# Altium schematic sheet Output.SchDoc: SoldeerStation
size A4; SheetNumber: 4; SheetTotal: 4
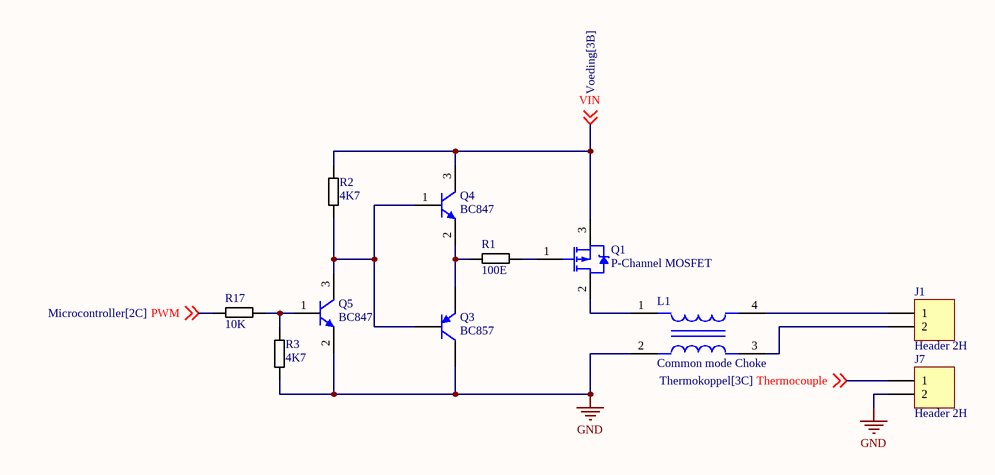
[diagram p0: Output.SchDoc]

## Parts
J1  Header 2H  [Connector_2x1_p_5mm]
J7  Header 2H  [Connector_2x1_p_5mm]
L1  Common mode Choke  [2545]
Q1  P-Channel MOSFET  [INF-PG-TO252-3-313_N]
Q3  BC857  [FAIR-SOT23-3_V]
Q4  BC847  [FAIR-SOT23-3_V]
Q5  BC847  [FAIR-SOT23-3_V]
R1  100E  [RESC2013X50X30ML20T20]
R2  4K7  [RESC2013X50X30ML20T20]
R3  4K7  [RESC2013X50X30ML20T20]
R17  10K  [RESC2013X50X30ML20T20]

## Nets
GND: J7.2 L1.2 Q3.3(C) Q5.2(E) R3.1
PWM: R17.1 ; off-sheet PWM
Thermocouple: J7.1 ; off-sheet Thermocouple
VIN: Q1.3(S) Q4.3(C) R2.2 ; off-sheet VIN
NetJ1_1: J1.1 L1.4
NetJ1_2: J1.2 L1.3
NetL1_1: L1.1 Q1.2(D)
NetQ1_1: Q1.1(G) R1.2
NetQ3_1: Q3.1(B) Q4.1(B) Q5.3(C) R2.1
NetQ3_2: Q3.2(E) Q4.2(E) R1.1
NetQ5_1: Q5.1(B) R3.2 R17.2

## Library data of the parts
J1 J7 = Header 2H: Header, 2-Pin, Right Angle; LatestRevisionDate: 17-Jul-2002; LatestRevisionNote: Re-released for DXP Platform.; Publisher: Altium Limited
L1 = Common mode Choke: Max Current Rating: 2A; Number of Lines: 2; Impedance: 900R; Element Configuration: Dual; Insulation Resistance: 10MR; Test Frequency: 100MHz; DC Resistance (DCR): 60mR; Voltage Rating (DC): 50V; Current Rating: 2.3A; Number of Pins: 4; DC Current: 2A; Mount: Surface Mount; Current: 2A; REACH SVHC: No SVHC; Width: 4.5mm; Case/Package: 1808; Voltage Rating: 50V; Package Quantity: 1; Height: 2mm; Max DC Current: 2A; Packaging: Tape and Reel; Max Operating Temperature: 85°C; Lead Free: Lead Free; Length: 0.185inch; Series: ACM; Radiation Hardening: No; Max Voltage Rating (DC): 50V; Termination: Flat; Depth: 4.7mm; RoHS Compliant: Yes; DC Resistance-Max: 60mR; Min Operating Temperature: -40°C
Q1 = P-Channel MOSFET: PartNumber: NTB5605PT4G; Manufacturer: On Semiconductor; ID Max (A): 18.5; VGS(th) Max (V): 2; Configuration: Single; Packing: Tape and Reel; Coss Typ (pF): 211; V(BR)DSS Min (V): 60; Qrr Typ (nC): 0.14; Channel Polarity: P Channel; Crss Typ (pF): 67; VGS Max (V): 20; Ciss Typ (pF): 730; PD Max (W): 88; ComponentLink1URL: http://www.onsemi.com/; ComponentLink3URL: http://www.onsemi.com/pub_link/Collateral/418B-04.PDF; PackageVersion: Rev. K, 09/2008; ComponentLink2Description: Datasheet; ComponentLink3Description: Package Specification; Package Type: D2PAK-3; ComponentLink2URL: http://www.onsemi.cn/pub_link/Collateral/NTB5605P-D.PDF; Mounting Technology: Surface Mount; ComponentLink1Description: Manufacturer URL; PackageReference: D2PAK-3-418B-04; DatasheetVersion: Rev. 4; PackageDescription: 3-Pin Flange Mount, Body 9.145 x 9.97 mm, Pitch 2.54 mm; RoHS: Pb-Free
Q3 = PNP transistor: Manufacturer: On Semiconductor; PartNumber: BC557BRL1G; IC Continuous (A): -0.1; Polarity: PNP; Packing: Tape and Reel; ComponentLink2URL: http://www.onsemi.com/pub_link/Collateral/BC556B-D.PDF; ComponentLink3URL: http://www.onsemi.com/pub_link/Collateral/MAC97-D.PDF; Mounting Technology: Through Hole; RoHS: TRUE; DatasheetVersion: Rev. 3; PackageReference: TO-92-3-29-11_AM_BL; PackageVersion: Rev. AM; PackageDescription: 3-Pin Transistor Outline, Body 4.825 x 3.685 mm, Pitch 1.27 mm; ComponentLink1URL: http://www.onsemi.com/; ComponentLink1Description: Manufacturer URL; ComponentLink2Description: Datasheet; ComponentLink3Description: Package Specification
Q4 Q5 = NPN Transistor: Manufacturer: On Semiconductor; PartNumber: BC547BRL1G; IC Continuous (A): 0.1; fT Min (MHz): 150; Packing: Tape and Reel; Polarity: NPN; ComponentLink2URL: http://www.onsemi.com/pub_link/Collateral/BC546-D.PDF; ComponentLink1URL: http://www.onsemi.com/; ComponentLink2Description: Datasheet; RoHS: TRUE; ComponentLink3Description: Package Specification; ComponentLink1Description: Manufacturer URL; ComponentLink3URL: http://www.onsemi.com/pub_link/Collateral/MAC97-D.PDF; PackageDescription: 3-Pin Transistor Outline, Body 4.825 x 3.685 mm, Pitch 1.27 mm; PackageVersion: Rev. AM; DatasheetVersion: Rev. 7; Mounting Technology: Through Hole; PackageReference: TO-92-3-29-11_AM_BL
R1-R3 R17 = Resistor: Manufacturer: Vishay Dale; Part Number: CRCW08050000Z0EA